# EAGLE schematic 2018_Dashboard (EAGLE 8.4.3)
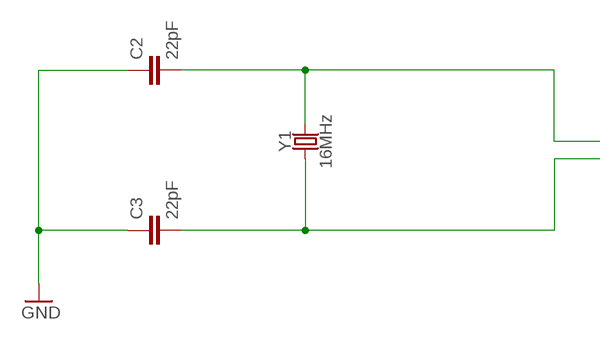
[diagram p0: schematic, sheet 1, part 1 of 2]
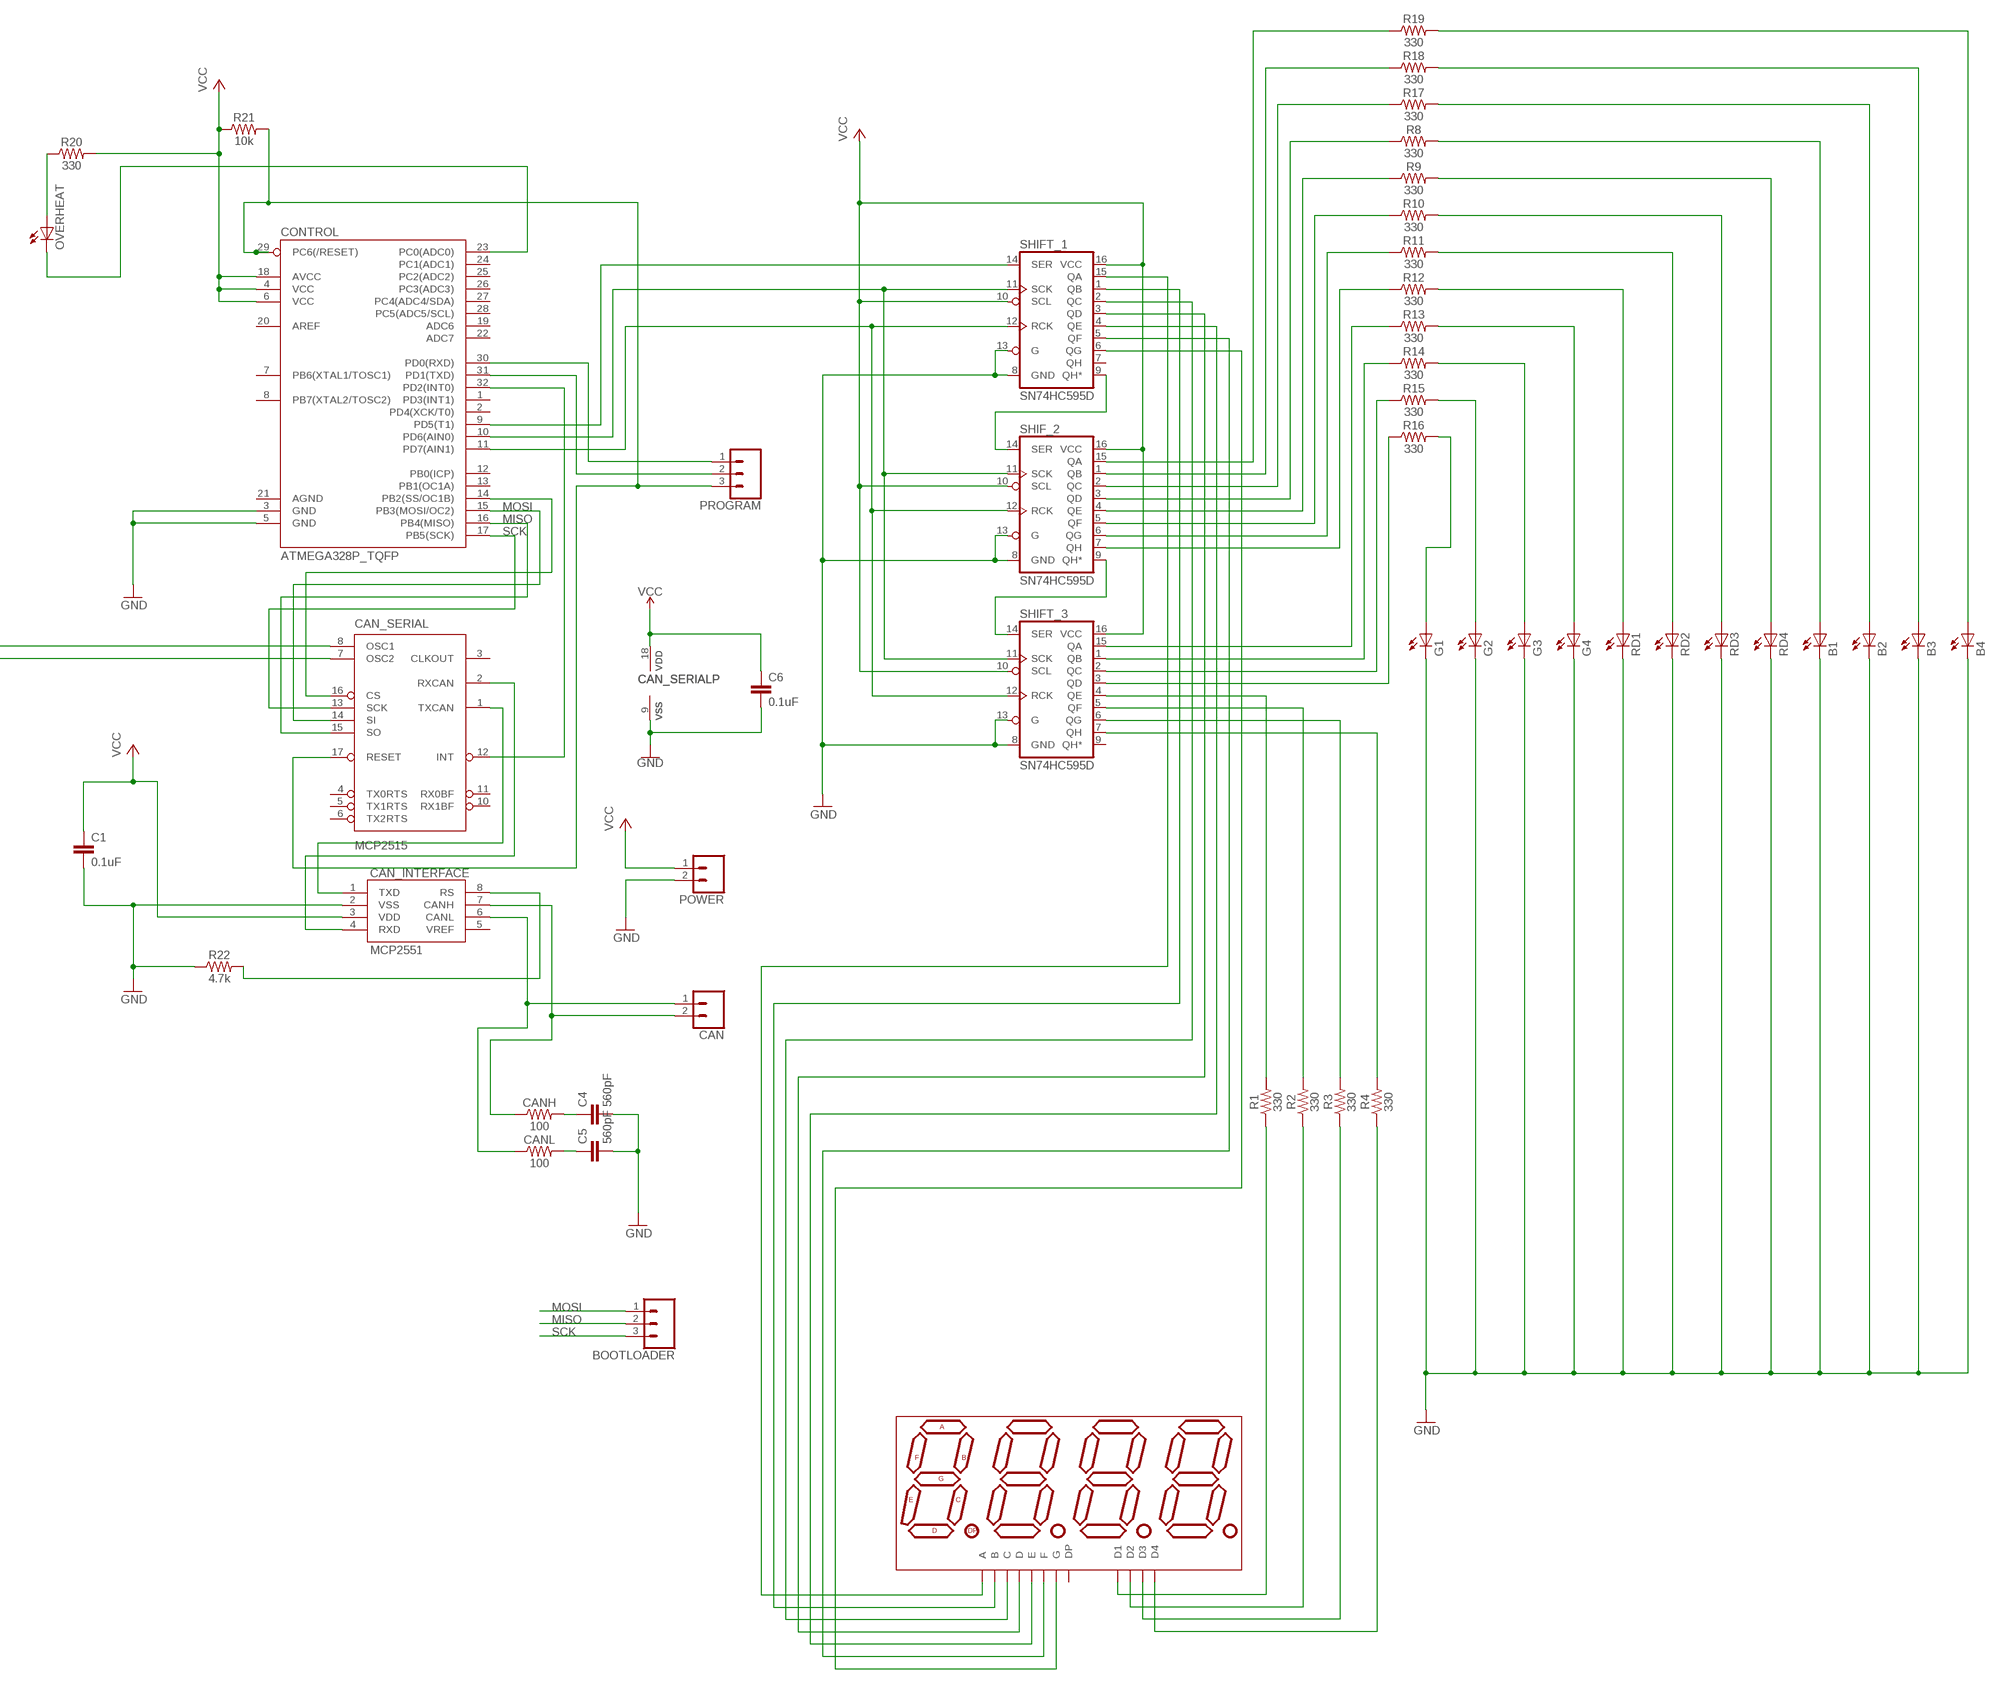
[diagram p1: schematic, sheet 1, part 2 of 2]

## Parts
B1  TLLG4400  [LED3MM]
B2  TLLG4400  [LED3MM]
B3  TLLG4400  [LED3MM]
B4  TLLG4400  [LED3MM]
BOOTLOADER  CONN_03  [1X03]
C1  0.1uF  0.1UF-0603-25V-(+80/-20%)  [0603]
C2  22pF  22PF-0603-50V-5%  [0603]
C3  22pF  22PF-0603-50V-5%  [0603]
C4  560pF  560PF-0603-50V-5%  [0603]
C5  560pF  560PF-0603-50V-5%  [0603]
C6  0.1uF  0.1UF-0402-16V-10%  [0402]
CAN  CONN_02  [1X02]
CAN_INTERFACE  MCP2551  [SO08]
CAN_SERIAL  MCP2515  MCP2515(MCP2510)SO  [SO18W]
CANH  100  100OHM-0603-1/4W-5%  [0603]
CANL  100  100OHM-0603-1/4W-5%  [0603]
CONTROL  ATMEGA328P_TQFP  [TQFP32-08]
G1  TLLG4400  [LED3MM]
G2  TLLG4400  [LED3MM]
G3  TLLG4400  [LED3MM]
G4  TLLG4400  [LED3MM]
OVERHEAT  TLLG4400  [LED3MM]
POWER  CONN_02  [1X02]
PROGRAM  CONN_03  [1X03]
R1  330  330OHM-0603-1/10W-1%  [0603]
R2  330  330OHM-0603-1/10W-1%  [0603]
R3  330  330OHM-0603-1/10W-1%  [0603]
R4  330  330OHM-0603-1/10W-1%  [0603]
R8  330  330OHM-0603-1/10W-1%  [0603]
R9  330  330OHM-0603-1/10W-1%  [0603]
R10  330  330OHM-0603-1/10W-1%  [0603]
R11  330  330OHM-0603-1/10W-1%  [0603]
R12  330  330OHM-0603-1/10W-1%  [0603]
R13  330  330OHM-0603-1/10W-1%  [0603]
R14  330  330OHM-0603-1/10W-1%  [0603]
R15  330  330OHM-0603-1/10W-1%  [0603]
R16  330  330OHM-0603-1/10W-1%  [0603]
R17  330  330OHM-0603-1/10W-1%  [0603]
R18  330  330OHM-0603-1/10W-1%  [0603]
R19  330  330OHM-0603-1/10W-1%  [0603]
R20  330  330OHM-0603-1/10W-1%  [0603]
R21  10k  10KOHM-0603-1/10W-1%  [0603]
R22  4.7k  4.7KOHM-0603-1/10W-1%  [0603]
RD1  TLLG4400  [LED3MM]
RD2  TLLG4400  [LED3MM]
RD3  TLLG4400  [LED3MM]
RD4  TLLG4400  [LED3MM]
SEVEN_SEGMENT  ATA8041AB  7-SEGMENT-4DIGIT-20MM-BLUE  [7-SEGMENT-4DIGIT-20MM]
SHIF_2  SN74HC595D  74HC595D  [SO16]
SHIFT_1  SN74HC595D  74HC595D  [SO16]
SHIFT_3  SN74HC595D  74HC595D  [SO16]
Y1  16MHz  CRYSTAL-16MHZPTH-HC49US  [HC49US]

## Nets
CANH: CAN.2 CAN_INTERFACE.7(CANH) CANH.1
CANL: CAN.1 CAN_INTERFACE.6(CANL) CANL.1
GND: B1.K(C) B2.K(C) B3.K(C) B4.K(C) C1.2 C2.1 C3.1 C4.2 C5.2 C6.2 CAN_INTERFACE.2(VSS) CAN_SERIAL.9(VSS) CONTROL.3(GND) CONTROL.5(GND) G1.K(C) G2.K(C) G3.K(C) G4.K(C) POWER.2 R22.1 RD1.K(C) RD2.K(C) RD3.K(C) RD4.K(C) SHIF_2.8(GND) SHIF_2.13(G) SHIFT_1.8(GND) SHIFT_1.13(G) SHIFT_3.8(GND) SHIFT_3.13(G)
MISO: BOOTLOADER.2 CAN_SERIAL.15(SO) CONTROL.16(PB4(MISO))
MOSI: BOOTLOADER.1 CAN_SERIAL.14(SI) CONTROL.15(PB3(MOSI/OC2))
N$1: CAN_INTERFACE.8(RS) R22.2
N$2: SHIF_2.14(SER) SHIFT_1.9(QH*)
N$3: R1.2 SHIFT_3.4(QE)
N$4: R2.2 SHIFT_3.5(QF)
N$5: R3.2 SHIFT_3.6(QG)
N$6: R4.2 SHIFT_3.7(QH)
N$10: SHIF_2.9(QH*) SHIFT_3.14(SER)
N$11: SEVEN_SEGMENT.11(A) SHIFT_1.15(QA)
N$12: SEVEN_SEGMENT.7(B) SHIFT_1.1(QB)
N$13: SEVEN_SEGMENT.4(C) SHIFT_1.2(QC)
N$14: SEVEN_SEGMENT.2(D) SHIFT_1.3(QD)
N$15: SEVEN_SEGMENT.1(E) SHIFT_1.4(QE)
N$16: SEVEN_SEGMENT.10(F) SHIFT_1.5(QF)
N$17: SEVEN_SEGMENT.5(G) SHIFT_1.6(QG)
N$18: B2.A R17.2
N$19: B3.A R18.2
N$20: CONTROL.9(PD5(T1)) SHIFT_1.14(SER)
N$21: CONTROL.10(PD6(AIN0)) SHIF_2.11(SCK) SHIFT_1.11(SCK) SHIFT_3.11(SCK)
N$22: CONTROL.11(PD7(AIN1)) SHIF_2.12(RCK) SHIFT_1.12(RCK) SHIFT_3.12(RCK)
N$23: B4.A R19.2
N$24: R1.1 SEVEN_SEGMENT.12(D1)
N$25: R19.1 SHIF_2.15(QA)
N$26: R18.1 SHIF_2.1(QB)
N$27: R17.1 SHIF_2.2(QC)
N$28: R8.1 SHIF_2.3(QD)
N$29: G1.A R16.2
N$30: G2.A R15.2
N$31: G3.A R14.2
N$32: G4.A R13.2
N$33: R12.2 RD1.A
N$34: R11.2 RD2.A
N$35: R10.2 RD3.A
N$36: R9.2 RD4.A
N$37: B1.A R8.2
N$39: R9.1 SHIF_2.4(QE)
N$40: R10.1 SHIF_2.5(QF)
N$41: R11.1 SHIF_2.6(QG)
N$42: R12.1 SHIF_2.7(QH)
N$43: R13.1 SHIFT_3.15(QA)
N$44: R14.1 SHIFT_3.1(QB)
N$45: R15.1 SHIFT_3.2(QC)
N$46: R16.1 SHIFT_3.3(QD)
N$47: R2.1 SEVEN_SEGMENT.9(D2)
N$48: R3.1 SEVEN_SEGMENT.8(D3)
N$49: R4.1 SEVEN_SEGMENT.6(D4)
N$50: OVERHEAT.A R20.1
N$51: CONTROL.23(PC0(ADC0)) OVERHEAT.K(C)
N$52: CAN_SERIAL.16(CS) CONTROL.14(PB2(SS/OC1B))
N$56: CAN_SERIAL.12(INT) CONTROL.32(PD2(INT0))
N$57: CAN_INTERFACE.1(TXD) CAN_SERIAL.1(TXCAN)
N$58: CAN_INTERFACE.4(RXD) CAN_SERIAL.2(RXCAN)
N$59: C3.2 CAN_SERIAL.7(OSC2) Y1.1
N$62: C4.1 CANH.2
N$63: C2.2 CAN_SERIAL.8(OSC1) Y1.2
N$65: C5.1 CANL.2
RST: CAN_SERIAL.17(RESET) CONTROL.29(PC6(/RESET)) PROGRAM.3 R21.2
RX: CONTROL.30(PD0(RXD)) PROGRAM.1
SCK: BOOTLOADER.3 CAN_SERIAL.13(SCK) CONTROL.17(PB5(SCK))
TX: CONTROL.31(PD1(TXD)) PROGRAM.2
VCC: C1.1 C6.1 CAN_INTERFACE.3(VDD) CAN_SERIAL.18(VDD) CONTROL.4(VCC) CONTROL.6(VCC) CONTROL.18(AVCC) POWER.1 R20.2 R21.1 SHIF_2.10(SCL) SHIF_2.16(VCC) SHIFT_1.10(SCL) SHIFT_1.16(VCC) SHIFT_3.10(SCL) SHIFT_3.16(VCC)
Unconnected: CAN_INTERFACE.5(VREF) CAN_SERIAL.3(CLKOUT) CAN_SERIAL.4(TX0RTS) CAN_SERIAL.5(TX1RTS) CAN_SERIAL.6(TX2RTS) CAN_SERIAL.10(RX1BF) CAN_SERIAL.11(RX0BF) CONTROL.1(PD3(INT1)) CONTROL.2(PD4(XCK/T0)) CONTROL.7(PB6(XTAL1/TOSC1)) CONTROL.8(PB7(XTAL2/TOSC2)) CONTROL.12(PB0(ICP)) CONTROL.13(PB1(OC1A)) CONTROL.19(ADC6) CONTROL.20(AREF) CONTROL.21(AGND) CONTROL.22(ADC7) CONTROL.24(PC1(ADC1)) CONTROL.25(PC2(ADC2)) CONTROL.26(PC3(ADC3)) CONTROL.27(PC4(ADC4/SDA)) CONTROL.28(PC5(ADC5/SCL)) SEVEN_SEGMENT.3(DP) SHIFT_1.7(QH) SHIFT_3.9(QH*)

## Library data of the parts
B1-B4 G1-G4 OVERHEAT RD1-RD4 = led:TLLG4400: Low Current (2mA) LED 3 mm Tinted Diffused Package color GREEN Source: Data sheet <http://www.farnell.com/datasheets/391098.pdf>; MF: VISHAY SEMICONDUCTOR; OC_FARNELL: 1612435
BOOTLOADER PROGRAM = SparkFun-Connectors:CONN_03: Multi connection point. Often used as Generic Header-pin footprint for 0.1 inch spaced/style header connections On any of the 0.1 inch spaced packages, you can populate with these: Break Away Headers - Straight <https://www.sparkfun.com/products/116> (PRT-00116) Break Away Male Headers - Right Angle <https://www.sparkfun.com/products/553> (PRT-00553) Female Headers <https://www.sparkfun.com/products/115> (PRT-00115) Break Away Headers - Machine Pin <https://www.sparkfun.com/products/117> (PRT-00117) Break Away Female Headers - Swiss Machine Pin <https://www.sparkfun.com/products/743> (PRT-00743) Stackable Header - 3 Pin (Female, 0.1") <https://www.sparkfun.com/products/13875> (PRT-13875) For SCREWTERMINALS and SPRING TERMINALS visit here: Screw Terimnals on SparkFun.com <https://www.sparkfun.com/search/results?term=Screw+Terminals> (5mm/3.5mm/2.54mm spacing) This device is also useful as a general connection point to wire up your design to another part of your project. Our various solder wires solder well into these plated through hole pads. Hook-Up Wire - Assortment (Stranded, 22 AWG) <https://www.sparkfun.com/products/11375> (PRT-11375) Hook-Up Wire - Assortment (Solid Core, 22 AWG) <https://www.sparkfun.com/products/11367> (PRT-11367) View the entire wire category on our website here <https://www.sparkfun.com/categories/141> Special notes: Molex polarized connector foot print use with SKU : PRT-08232 with associated crimp pins and housings.; PROD_ID: XXX-00000; VALUE: 455-1750-1-ND
C1 = SparkFun-Capacitors:0.1UF: 0.1µF ceramic capacitors A capacitor is a passive two-terminal electrical component used to store electrical energy temporarily in an electric field.; PROD_ID: CAP-00810
C2 C3 = SparkFun-Capacitors:22PF: 22pF ceramic capacitors A capacitor is a passive two-terminal electrical component used to store electrical energy temporarily in an electric field.; PROD_ID: CAP-07876
C4 C5 = SparkFun-Capacitors:560PF: 0.56nF/560pF ceramic capacitors A capacitor is a passive two-terminal electrical component used to store electrical energy temporarily in an electric field.; PROD_ID: CAP-08749
C6 = SparkFun-Capacitors:0.1UF: 0.1µF ceramic capacitors A capacitor is a passive two-terminal electrical component used to store electrical energy temporarily in an electric field.; PROD_ID: CAP-12416
CAN POWER = SparkFun-Connectors:CONN_02: Multi connection point. Often used as Generic Header-pin footprint for 0.1 inch spaced/style header connections On any of the 0.1 inch spaced packages, you can populate with these: Break Away Headers - Straight <https://www.sparkfun.com/products/116> (PRT-00116) Break Away Male Headers - Right Angle <https://www.sparkfun.com/products/553> (PRT-00553) Female Headers <https://www.sparkfun.com/products/115> (PRT-00115) Break Away Headers - Machine Pin <https://www.sparkfun.com/products/117> (PRT-00117) Break Away Female Headers - Swiss Machine Pin <https://www.sparkfun.com/products/743> (PRT-00743) For SCREWTERMINALS and SPRING TERMINALS visit here: Screw Terimnals on SparkFun.com <https://www.sparkfun.com/search/results?term=Screw+Terminals> (5mm/3.5mm/2.54mm spacing) This device is also useful as a general connection point to wire up your design to another part of your project. Our various solder wires solder well into these plated through hole pads. Hook-Up Wire - Assortment (Stranded, 22 AWG) <https://www.sparkfun.com/products/11375> (PRT-11375) Hook-Up Wire - Assortment (Solid Core, 22 AWG) <https://www.sparkfun.com/products/11367> (PRT-11367) View the entire wire category on our website here <https://www.sparkfun.com/categories/141> Special notes: Molex polarized connector foot print use with: PRT-08233 with associated crimp pins and housings. 2.54_SCREWTERM for use with PRT-10571. 3.5mm Screw Terminal footprints for PRT-08084 5mm Screw Terminal footprints for use with PRT-08432
CAN_INTERFACE = SparkFun-IC-Comms:MCP2551: MCP2551 High Speed CAN Transceiver High speed CAN transceiver Datasheet <http://www.sparkfun.com/datasheets/DevTools/Arduino/MCP2551.pdf> SparkFun Products CAN-BUS Shield <https://www.sparkfun.com/products/13262> (DEV-13262) SparkFun OBD-II UART <https://www.sparkfun.com/products/9555> (WIG-09555); PROD_ID: IC-09907
CAN_SERIAL = SparkFun-IC-Comms:MCP2515(MCP2510): CAN controller with SPI interface The MCP2515 controller supercedes the MCP2510 while addressing all errata associated with it. The two devices are pin compatible, either can be used with this device. 18-pin package SOIC Simple SPI interface to any MCU. One-shot mode ensures message transmission is attempted only once Databyte filtering Start-of-Frame (SOF) output Low-power CMOS Technology Datasheet <http://www.sparkfun.com/datasheets/DevTools/Arduino/MCP2515.pdf> SparkFun Products CAN-BUS Shield <https://www.sparkfun.com/products/13262> (DEV-13262); PROD_ID: IC-09906
CANH CANL = SparkFun-Resistors:100OHM: 100Ω resistor A resistor is a passive two-terminal electrical component that implements electrical resistance as a circuit element. Resistors act to reduce current flow, and, at the same time, act to lower voltage levels within circuits. - Wikipedia; PROD_ID: RES-12438
CONTROL = SparkFun-IC-Microcontroller:ATMEGA328P_TQFP: Popular 328P in QFP Storefront component: ATmega328 - TQFP <https://www.sparkfun.com/products/13448> (COM-13448) Datasheet <http://www.sparkfun.com/datasheets/Components/SMD/ATMega328.pdf> SparkFun Products SparkFun RedBoard - Programmed with Arduino <https://www.sparkfun.com/products/12757> (DEV-12757) Arduino Pro Mini 328 - 5V/16MHz <https://www.sparkfun.com/products/11113> (DEV-11113) Arduino Pro Mini 328 - 3.3V/8MHz <https://www.sparkfun.com/products/11114> (DEV-11114) SparkFun OpenLog <https://www.sparkfun.com/products/13712> (DEV-13712) SparkFun MicroView - OLED Arduino Module <https://www.sparkfun.com/products/12923> (DEV-12923) SparkFun Digital Sandbox <https://www.sparkfun.com/products/12651> (DEV-12651) SparkFun PicoBoard <https://www.sparkfun.com/products/11888> (WIG-11888) Arduino Fio <https://www.sparkfun.com/products/10116> (DEV-10116) LilyPad Arduino 328 Main Board <https://www.sparkfun.com/products/13342> (DEV-13342) SparkFun RedStick <https://www.sparkfun.com/products/13741> (DEV-13741) LilyPad MP3 <https://www.sparkfun.com/products/11013> (DEV-11013) LilyPad Arduino SimpleSnap <https://www.sparkfun.com/products/10941> (DEV-10941) SparkFun Stepoko <https://www.sparkfun.com/products/13899> (ROB-13899) SparkFun Geiger Counter <https://www.sparkfun.com/products/11345> (SEN-11345) SparkFun EL Sequencer <https://www.sparkfun.com/products/12781> (COM-12781) Arduino Pro 328 - 5V/16MHz <https://www.sparkfun.com/products/10915> (DEV-10915) CryptoCape <https://www.sparkfun.com/products/12773> (DEV-12773) SparkFun IR Thermometer Evaluation Board - MLX90614 <https://www.sparkfun.com/products/10740> (SEN-10740) SparkFun RedBot Mainboard <https://www.sparkfun.com/products/12097> (ROB-12097) Arduino Pro 328 - 3.3V/8MHz <https://www.sparkfun.com/products/10914> (DEV-10914) SparkFun Block for Intel® Edison - Arduino <https://www.sparkfun.com/products/13036> (DEV-13036) SparkFun Simon Says - Surface Mount Soldering Kit <https://www.sparkfun.com/products/10935> (KIT-10935) SparkFun 7-Segment Serial Display - Red <https://www.sparkfun.com/products/11441> (COM-11441) SparkFun 7-Segment Serial Display - White <https://www.sparkfun.com/products/11629> (COM-11629) SparkFun 7-Segment Serial Display - Yellow <https://www.sparkfun.com/products/11443> (COM-11443) SparkFun 7-Segment Serial Display - Kelly Green <https://www.sparkfun.com/products/11440> (COM-11440) SparkFun 7-Segment Serial Display - Blue <https://www.sparkfun.com/products/11442> (COM-11442) SparkFun OpenSegment Serial Display - 20mm (Blue) <https://www.sparkfun.com/products/11647> (COM-11647) SparkFun OpenSegment Serial Display - 20mm (Green) <https://www.sparkfun.com/products/11646> (COM-11646) SparkFun OpenSegment Serial Display - 20mm (White) <https://www.sparkfun.com/products/11648> (COM-11648) SparkFun OpenSegment Serial Display - 20mm (Red) <https://www.sparkfun.com/products/11644> (COM-11644) SparkFun OpenSegment Serial Display - 20mm (Yellow) <https://www.sparkfun.com/products/11645> (COM-11645) SparkFun OpenSegment Shield <https://www.sparkfun.com/products/13190> (DEV-13190); PROD_ID: IC-09069
R1-R4 R8-R20 = SparkFun-Resistors:330OHM: 330Ω resistor A resistor is a passive two-terminal electrical component that implements electrical resistance as a circuit element. Resistors act to reduce current flow, and, at the same time, act to lower voltage levels within circuits. - Wikipedia; PROD_ID: RES-00818
R21 = SparkFun-Resistors:10KOHM: 10kΩ resistor A resistor is a passive two-terminal electrical component that implements electrical resistance as a circuit element. Resistors act to reduce current flow, and, at the same time, act to lower voltage levels within circuits. - Wikipedia; PROD_ID: RES-00824
R22 = SparkFun-Resistors:4.7KOHM: 4.7kΩ resistor A resistor is a passive two-terminal electrical component that implements electrical resistance as a circuit element. Resistors act to reduce current flow, and, at the same time, act to lower voltage levels within circuits. - Wikipedia; PROD_ID: RES-07857
SEVEN_SEGMENT = SparkFun-LED:7-SEGMENT-4DIGIT-20MM: 4 Digit 7 Segment Display This is a part for the 4-Digit 7-segment LEDs from Young Sun. Different from the Digikey LEDs, all 16 pins are used. The LONGPADS Variant is used for a test jig, but you may like it because there is more pad to solder to. If you are concerned about routing space, the standard works just fine though. Datasheets: Red <http://cdn.sparkfun.com/datasheets/Components/LED/1LEDREDCC.pdf> Yellow <http://cdn.sparkfun.com/datasheets/Components/LED/1LEDYELCC.pdf> Green <http://cdn.sparkfun.com/datasheets/Components/LED/1LEDGRNCC.pdf> Blue <http://cdn.sparkfun.com/datasheets/Components/LED/1LEDBLUCC.pdf> White <http://cdn.sparkfun.com/datasheets/Components/LED/1LEDWHTCC.pdf> SparkFun Products Raw Components 7-Segment Display - 20mm (Red) <https://www.sparkfun.com/products/11405> (COM-11405) 7-Segment Display - 20mm (Yellow) <https://www.sparkfun.com/products/11406> (COM-11406) 7-Segment Display - 20mm (Green) <https://www.sparkfun.com/products/11407> (COM-11407) 7-Segment Display - 20mm (Blue) <https://www.sparkfun.com/products/11408> (COM-11408) 7-Segment Display - 20mm (White) <https://www.sparkfun.com/products/11409> (COM-11409) Serial Controlled SparkFun OpenSegment Serial Display - 20mm (Red) <https://www.sparkfun.com/products/11644> (COM-11644) SparkFun OpenSegment Serial Display - 20mm (Yellow) <https://www.sparkfun.com/products/11645> (COM-11645) SparkFun OpenSegment Serial Display - 20mm (Green) <https://www.sparkfun.com/products/11646> (COM-11646) SparkFun OpenSegment Serial Display - 20mm (Blue) <https://www.sparkfun.com/products/11647> (COM-11647) SparkFun OpenSegment Serial Display - 20mm (White) <https://www.sparkfun.com/products/11648> (COM-11648) Other SparkFun OpenSegment Shield <https://www.sparkfun.com/products/13190> (DEV-13190); PROD_ID: COMP-11446
SHIF_2 SHIFT_1 SHIFT_3 = SparkFun-IC-Logic:74*595: 8-Bit Shift Register (Serial to Parallel) Datasheet <http://cdn.sparkfun.com/datasheets/BreakoutBoards/MM74HC595.pdf> SparkFun Products SparkFun Shift Register Breakout - 74HC595 <https://www.sparkfun.com/products/10680> (BOB-10680); PROD_ID: IC-07875
Y1 = SparkFun-Clocks:CRYSTAL-16MHZ: 16MHz Crystal Digikey Example <http://www.digikey.com/product-search/en?keywords=535-9122-1-ND> Frequency: 16MHz Frequency Stability: ±50ppm Frequency Tolerance: ±20ppm Load Capacitance: 18pF SparkFun Products: Pro Micro -5V/16MHz <https://www.sparkfun.com/products/12640> SparkFun Serial Enabled LCD Kit <https://www.sparkfun.com/products/10097>; PROD_ID: XTAL-08181; SF_ID: COM-00536